# EAGLE schematic 6 pin plank (EAGLE 6.2)
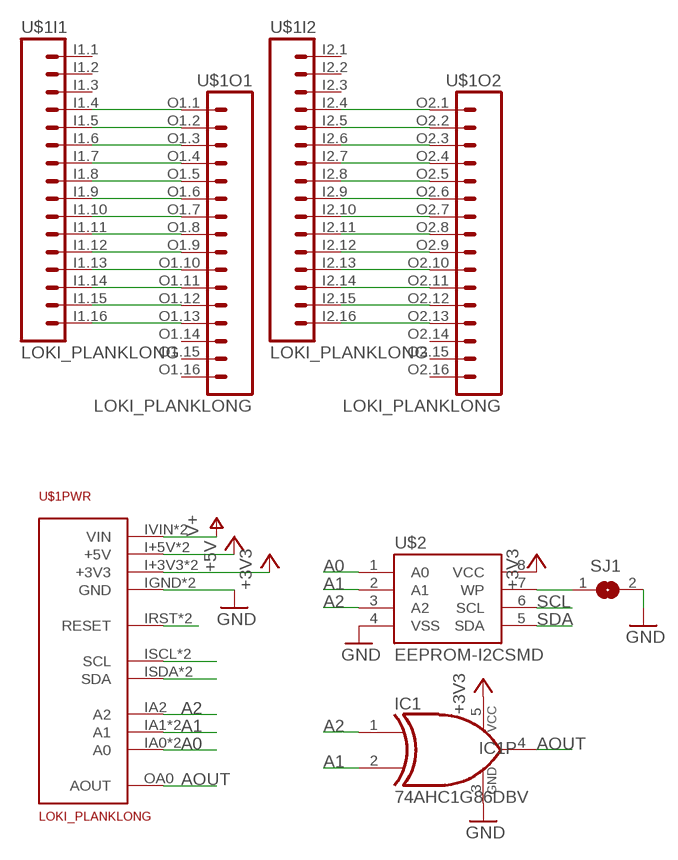
[diagram p0: schematic, sheet 1]

## Parts
IC1  74AHC1G86DBV  [SOT23-5]
SJ1  SJ  [SJ]
U$1  LOKI_PLANKLONG  [PLANK_LONG]
U$2  EEPROM-I2CSMD  [SO08]

## Nets
+3V3: IC1.5(VCC) U$1.I+3V3(PWR:+3V3) U$1.O+3V3(PWR:+3V3) U$2.8(VCC)
+5V: U$1.I+5V(PWR:+5V) U$1.O+5V(PWR:+5V)
A0: U$1.IA0(PWR:A0) U$1.OA1(PWR:A0) U$2.1(A0)
A1: IC1.2(I1) U$1.IA1(PWR:A1) U$1.OA2(PWR:A1) U$2.2(A1)
A2: IC1.1(I0) U$1.IA2(PWR:A2) U$2.3(A2)
AOUT: IC1.4(O) U$1.OA0(PWR:AOUT)
GND: IC1.3(GND) SJ1.2 U$1.IGND(PWR:GND) U$1.OGND(PWR:GND) U$2.4(VSS)
N$1: U$1.I1.16 U$1.O1.13
N$2: U$1.I1.15 U$1.O1.12
N$3: U$1.I1.14 U$1.O1.11
N$4: U$1.I1.13 U$1.O1.10
N$5: U$1.I1.12 U$1.O1.9
N$6: U$1.I1.11 U$1.O1.8
N$7: U$1.I1.10 U$1.O1.7
N$8: U$1.I1.9 U$1.O1.6
N$9: U$1.I1.8 U$1.O1.5
N$10: U$1.I1.7 U$1.O1.4
N$11: U$1.I1.6 U$1.O1.3
N$12: U$1.I1.5 U$1.O1.2
N$13: U$1.I1.4 U$1.O1.1
N$14: U$1.I2.16 U$1.O2.13
N$15: U$1.I2.15 U$1.O2.12
N$16: U$1.I2.14 U$1.O2.11
N$17: U$1.I2.13 U$1.O2.10
N$18: U$1.I2.12 U$1.O2.9
N$19: U$1.I2.11 U$1.O2.8
N$20: U$1.I2.10 U$1.O2.7
N$21: U$1.I2.9 U$1.O2.6
N$22: U$1.I2.8 U$1.O2.5
N$23: U$1.I2.7 U$1.O2.4
N$24: U$1.I2.6 U$1.O2.3
N$25: U$1.I2.5 U$1.O2.2
N$26: U$1.I2.4 U$1.O2.1
N$31: SJ1.1 U$2.7(WP)
N$32: U$1.IRST(PWR:RESET) U$1.ORST(PWR:RESET)
SCL: U$1.ISCL(PWR:SCL) U$1.OSCL(PWR:SCL) U$2.6(SCL)
SDA: U$1.ISDA(PWR:SDA) U$1.OSDA(PWR:SDA) U$2.5(SDA)
V+: U$1.IVIN(PWR:VIN) U$1.OVIN(PWR:VIN)
Unconnected: U$1.I1.1 U$1.I1.2 U$1.I1.3 U$1.I2.1 U$1.I2.2 U$1.I2.3 U$1.O1.14 U$1.O1.15 U$1.O1.16 U$1.O2.14 U$1.O2.15 U$1.O2.16

## Library data of the parts
IC1 = 74xx-little-us:74*1G86: 2-input EXCLUSIV-OR gate
SJ1 = jumper:SJ: SMD solder JUMPER
U$1 = loki:LOKI_PLANK
U$2 = SparkFun-DigitalIC:EEPROM-I2C: I2C EEPROM chips, 24LC256 (and others)